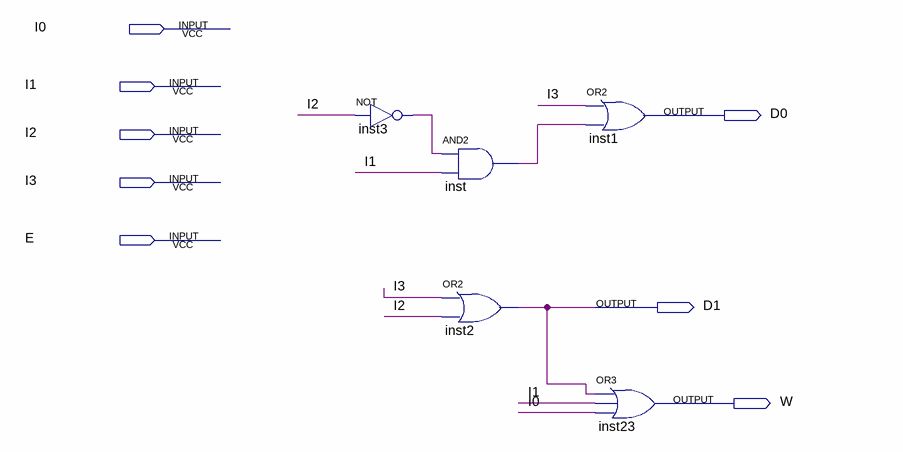
[diagram p0: schematic sheet]
// Quartus schematic PCD4_2.bdf as structural Verilog: 5 symbols, 8 pins
module PCD4_2 (
  input  I0,
  input  I1,
  input  I2,
  input  I3,
  input  E,
  output D0,
  output D1,
  output W
);

  wire inst3_out, inst_out;

  not inst3 (inst3_out, I2);
  and inst (inst_out, inst3_out, I1);
  or inst2 (D1, I3, I2);
  or inst1 (D0, I3, inst_out);
  or inst23 (W, D1, I1, I0);
endmodule
